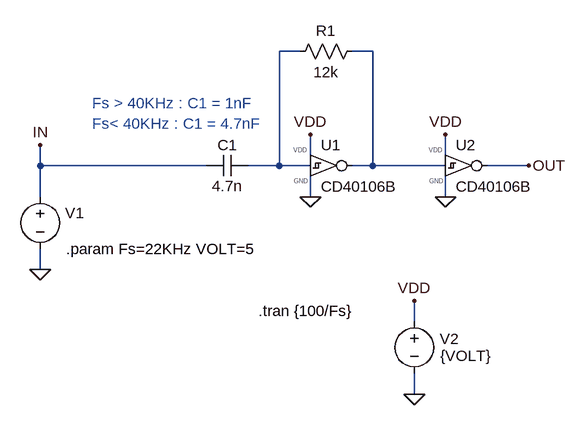
[diagram p0: schematic v1.0.asc]
v1.0.asc, the LTspice schematic file:
Version 4.1
SHEET 1 1012 680
WIRE 592 0 560 0
WIRE 704 0 672 0
WIRE 608 160 608 128
WIRE 816 160 816 128
WIRE 192 176 192 144
WIRE 448 176 192 176
WIRE 560 176 560 0
WIRE 560 176 512 176
WIRE 608 176 560 176
WIRE 704 176 704 0
WIRE 704 176 672 176
WIRE 816 176 704 176
WIRE 944 176 880 176
WIRE 192 224 192 176
WIRE 608 224 608 192
WIRE 816 224 816 192
WIRE 192 336 192 304
WIRE 768 416 768 384
WIRE 768 528 768 496
FLAG 192 336 0
FLAG 608 224 0
FLAG 768 528 0
FLAG 768 384 VDD
FLAG 608 128 VDD
FLAG 816 224 0
FLAG 816 128 VDD
FLAG 944 176 OUT
FLAG 192 144 IN
SYMBOL res 688 -16 R90
WINDOW 0 0 56 VBottom 2
WINDOW 3 32 56 VTop 2
SYMATTR InstName R1
SYMATTR Value 12k
SYMBOL voltage 192 208 R0
WINDOW 0 38 41 Left 2
WINDOW 3 42 65 Invisible 2
WINDOW 123 0 0 Left 0
WINDOW 39 0 0 Left 0
SYMATTR InstName V1
SYMATTR Value PULSE(0 {VOLT} {10/Fs} {0.01/Fs} {0.01/Fs} {0.5/Fs} {1/Fs} 50)
SYMBOL voltage 768 400 R0
WINDOW 0 39 43 Left 2
WINDOW 3 40 69 Left 2
WINDOW 123 0 0 Left 0
WINDOW 39 0 0 Left 0
SYMATTR InstName V2
SYMATTR Value {VOLT}
SYMBOL cap 512 160 R90
WINDOW 0 0 32 VBottom 2
WINDOW 3 32 32 VTop 2
SYMATTR InstName C1
SYMATTR Value 4.7n
SYMBOL MyLib\\Digital\\CD40106B 608 144 R0
SYMATTR InstName U1
SYMBOL MyLib\\Digital\\CD40106B 816 144 R0
SYMATTR InstName U2
TEXT 528 400 Left 2 !.tran {100/Fs}
TEXT 232 304 Left 2 !.param Fs=22KHz VOLT=5
TEXT 272 80 Left 2 ;Fs > 40KHz : C1 = 1nF\nFs< 40KHz : C1 = 4.7nF

The netlist it stands for:
* v1.0.asc
R1 N002 N001 12k
V1 IN 0 PULSE(0 {VOLT} {10/Fs} {0.01/Fs} {0.01/Fs} {0.5/Fs} {1/Fs} 50)
V2 VDD 0 {VOLT}
C1 N001 IN 4.7n
X§U1 N001 N002 VDD 0 CD40106B vdd=5 speed=2 tripdt=100n  ; pins in out VDD GND
X§U2 N002 OUT VDD 0 CD40106B vdd=5 speed=2 tripdt=100n  ; pins in out VDD GND
.tran {100/Fs}
.param Fs=22KHz VOLT=5
* Fs > 40KHz : C1 = 1nF
* Fs< 40KHz : C1 = 4.7nF
.lib MyLib/Digital/_CD4xxx.lib
.backanno
.end